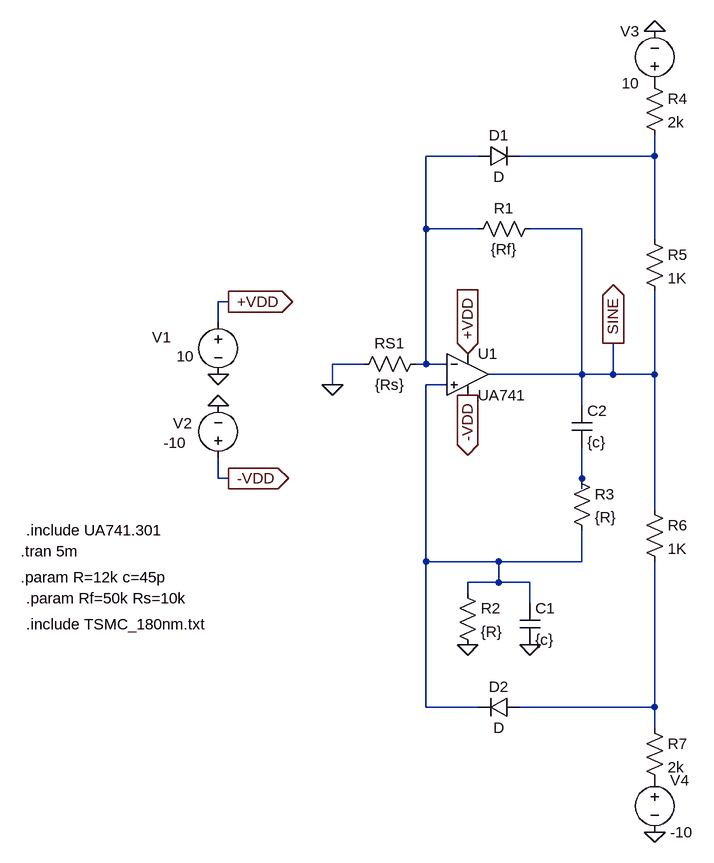
[diagram p0: schematic oscillator.asc]
oscillator.asc, the LTspice schematic file:
Version 4
SHEET 1 1372 1076
WIRE 912 16 832 16
WIRE 1184 16 1184 -16
WIRE 1184 16 976 16
WIRE 832 128 832 16
WIRE 912 128 832 128
WIRE 1072 128 992 128
WIRE 1184 144 1184 16
WIRE 528 240 512 240
WIRE 512 272 512 240
WIRE 736 336 688 336
WIRE 832 336 832 128
WIRE 832 336 816 336
WIRE 864 336 832 336
WIRE 1072 352 1072 128
WIRE 1072 352 928 352
WIRE 1120 352 1120 304
WIRE 1120 352 1072 352
WIRE 1184 352 1184 224
WIRE 1184 352 1120 352
WIRE 688 368 688 336
WIRE 864 368 832 368
WIRE 1072 400 1072 352
WIRE 512 512 512 480
WIRE 528 512 512 512
WIRE 1072 512 1072 464
WIRE 1072 528 1072 512
WIRE 1184 560 1184 352
WIRE 832 640 832 368
WIRE 944 640 832 640
WIRE 1072 640 1072 592
WIRE 1072 640 944 640
WIRE 944 672 944 640
WIRE 944 672 896 672
WIRE 992 672 944 672
WIRE 896 688 896 672
WIRE 992 704 992 672
WIRE 832 864 832 640
WIRE 912 864 832 864
WIRE 1184 864 1184 640
WIRE 1184 864 976 864
WIRE 1184 896 1184 864
FLAG 512 352 0
FLAG 512 400 0
FLAG 528 240 +VDD
IOPIN 528 240 Out
FLAG 528 512 -VDD
IOPIN 528 512 Out
FLAG 896 320 +VDD
IOPIN 896 320 In
FLAG 896 384 -VDD
IOPIN 896 384 Out
FLAG 688 368 0
FLAG 896 768 0
FLAG 992 768 0
FLAG 1120 304 SINE
IOPIN 1120 304 Out
FLAG 1184 1056 0
FLAG 1184 -176 0
DATAFLAG 1184 16 ""
DATAFLAG 1184 880 ""
SYMBOL voltage 512 256 R0
WINDOW 0 -102 39 Left 2
WINDOW 3 -64 68 Left 2
WINDOW 123 0 0 Left 0
WINDOW 39 0 0 Left 0
SYMATTR InstName V1
SYMATTR Value 10
SYMBOL voltage 512 496 R180
WINDOW 0 40 69 Left 2
WINDOW 3 49 39 Left 2
WINDOW 123 0 0 Left 0
WINDOW 39 0 0 Left 0
SYMATTR InstName V2
SYMATTR Value -10
SYMBOL OpAmps\\opamp2 896 288 R0
SYMATTR InstName U1
SYMATTR Value UA741
SYMBOL res 832 320 R90
WINDOW 0 0 56 VBottom 2
WINDOW 3 32 56 VTop 2
SYMATTR InstName RS1
SYMATTR Value {Rs}
SYMBOL res 1008 112 R90
WINDOW 0 0 56 VBottom 2
WINDOW 3 32 56 VTop 2
SYMATTR InstName R1
SYMATTR Value {Rf}
SYMBOL res 880 672 R0
SYMATTR InstName R2
SYMATTR Value {R}
SYMBOL cap 976 704 R0
SYMATTR InstName C1
SYMATTR Value {c}
SYMBOL res 1056 496 R0
SYMATTR InstName R3
SYMATTR Value {R}
SYMBOL cap 1056 400 R0
SYMATTR InstName C2
SYMATTR Value {c}
SYMBOL diode 912 32 R270
WINDOW 0 32 32 VTop 2
WINDOW 3 0 32 VBottom 2
SYMATTR InstName D1
SYMBOL diode 976 848 R90
WINDOW 0 0 32 VBottom 2
WINDOW 3 32 32 VTop 2
SYMATTR InstName D2
SYMBOL res 1168 -112 R0
SYMATTR InstName R4
SYMATTR Value 2k
SYMBOL res 1168 128 R0
SYMATTR InstName R5
SYMATTR Value 1K
SYMBOL res 1168 544 R0
SYMATTR InstName R6
SYMATTR Value 1K
SYMBOL res 1168 880 R0
SYMATTR InstName R7
SYMATTR Value 2k
SYMBOL voltage 1184 -80 R180
WINDOW 0 24 96 Left 2
WINDOW 3 24 16 Left 2
WINDOW 123 0 0 Left 0
WINDOW 39 0 0 Left 0
SYMATTR InstName V3
SYMATTR Value 10
SYMBOL voltage 1184 960 R0
WINDOW 123 0 0 Left 0
WINDOW 39 0 0 Left 0
SYMATTR InstName V4
SYMATTR Value -10
TEXT 216 736 Left 2 !.include TSMC_180nm.txt
TEXT 208 624 Left 2 !.tran 5m
TEXT 208 664 Left 2 !.param R=12k c=45p
TEXT 216 696 Left 2 !.param Rf=50k Rs=10k
TEXT 216 592 Left 2 !.include UA741.301

The netlist it stands for:
* oscillator.asc
V1 +VDD 0 10
V2 -VDD 0 -10
XU1 N003 N001 +VDD -VDD SINE UA741  ; pins In+ In- V+ V- OUT
RS1 N001 0 {Rs}
R1 SINE N001 {Rf}
R2 N003 0 {R}
C1 N003 0 {c}
R3 N004 N003 {R}
C2 SINE N004 {c}
D1 N001 N002 D
D2 N005 N003 D
R4 P001 N002 2k
R5 N002 SINE 1K
R6 SINE N005 1K
R7 N005 P002 2k
V3 P001 0 10
V4 P002 0 -10
.model D D
.lib standard.dio
.include TSMC_180nm.txt
.tran 5m
.param R=12k c=45p
.param Rf=50k Rs=10k
.include UA741.301
.backanno
.end